# Altium schematic sheet SCH_Altium_OpenComs_ABP1_Front-panel_.schdoc
size 298 x 106 mm
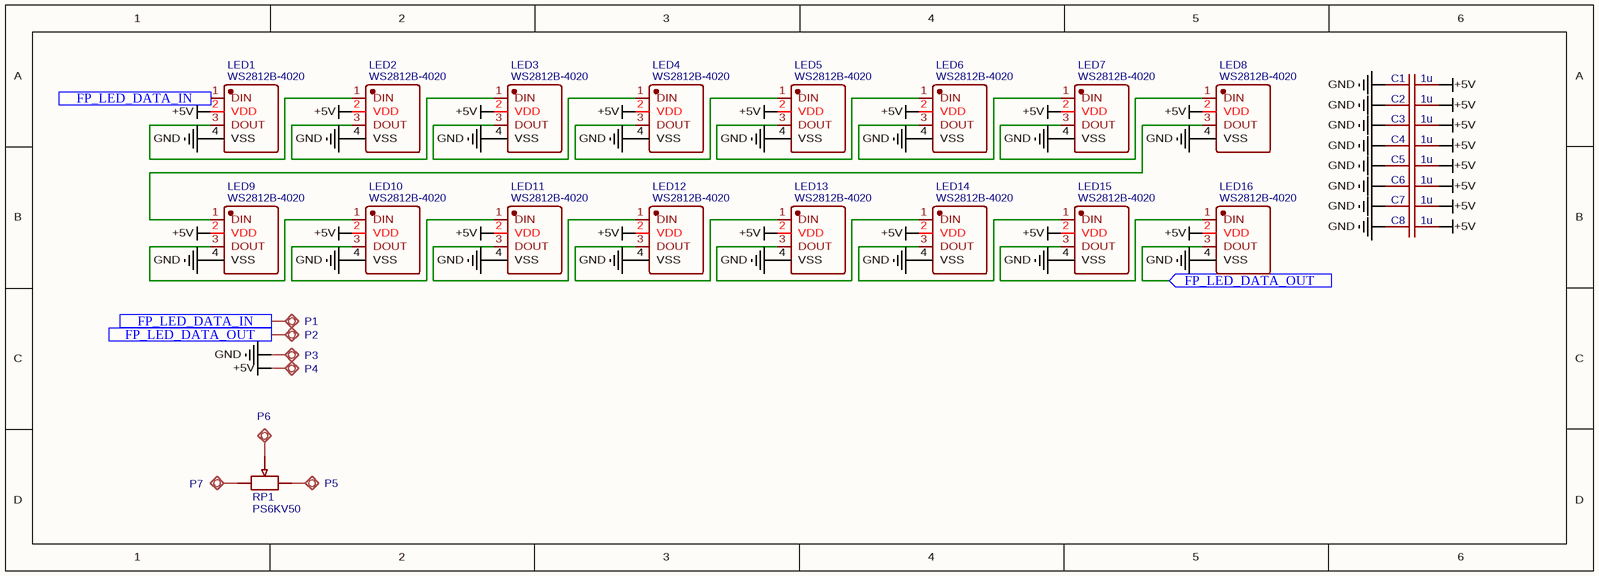
[diagram p0: SCH_Altium_OpenComs_ABP1_Front-panel_.schdoc]

## Parts
C1  1u  [C0805]
C2  1u  [C0805]
C3  1u  [C0805]
C4  1u  [C0805]
C5  1u  [C0805]
C6  1u  [C0805]
C7  1u  [C0805]
C8  1u  [C0805]
LED1  WS2812B-4020  [LED-SMD_WS2812B-4020]
LED2  WS2812B-4020  [LED-SMD_WS2812B-4020]
LED3  WS2812B-4020  [LED-SMD_WS2812B-4020]
LED4  WS2812B-4020  [LED-SMD_WS2812B-4020]
LED5  WS2812B-4020  [LED-SMD_WS2812B-4020]
LED6  WS2812B-4020  [LED-SMD_WS2812B-4020]
LED7  WS2812B-4020  [LED-SMD_WS2812B-4020]
LED8  WS2812B-4020  [LED-SMD_WS2812B-4020]
LED9  WS2812B-4020  [LED-SMD_WS2812B-4020]
LED10  WS2812B-4020  [LED-SMD_WS2812B-4020]
LED11  WS2812B-4020  [LED-SMD_WS2812B-4020]
LED12  WS2812B-4020  [LED-SMD_WS2812B-4020]
LED13  WS2812B-4020  [LED-SMD_WS2812B-4020]
LED14  WS2812B-4020  [LED-SMD_WS2812B-4020]
LED15  WS2812B-4020  [LED-SMD_WS2812B-4020]
LED16  WS2812B-4020  [LED-SMD_WS2812B-4020]
P1  TESTPAD50  [TESTPAD-50-ROUND]  (value not drawn)
P2  TESTPAD50  [TESTPAD-50-ROUND]  (value not drawn)
P3  TESTPAD50  [TESTPAD-50-ROUND]  (value not drawn)
P4  TESTPAD50  [TESTPAD-50-ROUND]  (value not drawn)
P5  TESTPAD50  [TESTPAD-50-ROUND]  (value not drawn)
P6  TESTPAD50  [TESTPAD-50-ROUND]  (value not drawn)
P7  TESTPAD50  [TESTPAD-50-ROUND]  (value not drawn)
RP1  PS6KV50  [PS6_POTMETER]

## Ports
FP_LED_DATA_IN (in), FP_LED_DATA_OUT (in)

## Nets
+5V: C1.2 C2.2 C3.2 C4.2 C5.2 C6.2 C7.2 C8.2 LED1.2(VDD) LED2.2(VDD) LED3.2(VDD) LED4.2(VDD) LED5.2(VDD) LED6.2(VDD) LED7.2(VDD) LED8.2(VDD) LED9.2(VDD) LED10.2(VDD) LED11.2(VDD) LED12.2(VDD) LED13.2(VDD) LED14.2(VDD) LED15.2(VDD) LED16.2(VDD) P4.1(PP)
GND: C1.1 C2.1 C3.1 C4.1 C5.1 C6.1 C7.1 C8.1 LED1.4(VSS) LED2.4(VSS) LED3.4(VSS) LED4.4(VSS) LED5.4(VSS) LED6.4(VSS) LED7.4(VSS) LED8.4(VSS) LED9.4(VSS) LED10.4(VSS) LED11.4(VSS) LED12.4(VSS) LED13.4(VSS) LED14.4(VSS) LED15.4(VSS) LED16.4(VSS) P3.1(PP)
FP_LED_DATA_IN: LED1.1(DIN) P1.1(PP) ; port FP_LED_DATA_IN
FP_LED_DATA_OUT: LED16.3(DOUT) P2.1(PP) ; port FP_LED_DATA_OUT
NetLED1_3: LED1.3(DOUT) LED2.1(DIN)
NetLED2_3: LED2.3(DOUT) LED3.1(DIN)
NetLED3_3: LED3.3(DOUT) LED4.1(DIN)
NetLED4_3: LED4.3(DOUT) LED5.1(DIN)
NetLED5_3: LED5.3(DOUT) LED6.1(DIN)
NetLED6_3: LED6.3(DOUT) LED7.1(DIN)
NetLED7_3: LED7.3(DOUT) LED8.1(DIN)
NetLED8_3: LED8.3(DOUT) LED9.1(DIN)
NetLED9_3: LED9.3(DOUT) LED10.1(DIN)
NetLED10_3: LED10.3(DOUT) LED11.1(DIN)
NetLED11_3: LED11.3(DOUT) LED12.1(DIN)
NetLED12_3: LED12.3(DOUT) LED13.1(DIN)
NetLED13_3: LED13.3(DOUT) LED14.1(DIN)
NetLED14_3: LED14.3(DOUT) LED15.1(DIN)
NetLED15_3: LED15.3(DOUT) LED16.1(DIN)
NetP5_1: P5.1(PP) RP1.3
NetP6_1: P6.1(PP) RP1.2
NetP7_1: P7.1(PP) RP1.1

## Library data of the parts
C1-C8 = 1u: BOM_Manufacturer Part: CL21B105KBFNNNE; BOM_Manufacturer: SAMSUNG(三星); nameAlias: Value(F); Contributor: LCEDA_Lib; BOM_Supplier Part: C28323; BOM_Supplier: LCSC; spicePre: C; spiceSymbolName: C_0805_US
LED1-LED16 = WS2812B-4020: BOM_Manufacturer: worldsemi; Contributor: LCSC; BOM_Supplier: LCSC; BOM_Supplier Part: C965557; BOM_Manufacturer Part: WS2812B-4020; BOM_JLCPCB Part Class: Extended Part; spicePre: L; spiceSymbolName: WS2812B-4020
P1-P7 = TESTPAD50: Contributor: radiofm; spicePre: P; spiceSymbolName: TESTPAD50
RP1 = PS6KV50: BOM_Manufacturer: PIHER; BOM_Manufacturer Part: PS6KV50-103A3030-I-PM; Contributor: ViperPiz; BOM_Supplier: TME; BOM_Supplier Part: PS6KV50-103A-I-PM; link: https://www.piher.net/sensors/index.php/component/virtuemart/?page=shop.product_details&flypage=flypage.tpl&product_id=40&category_id=2; spicePre: R; spiceSymbolName: PS6KV50